# Altium project RemoteBoard.PrjPcb
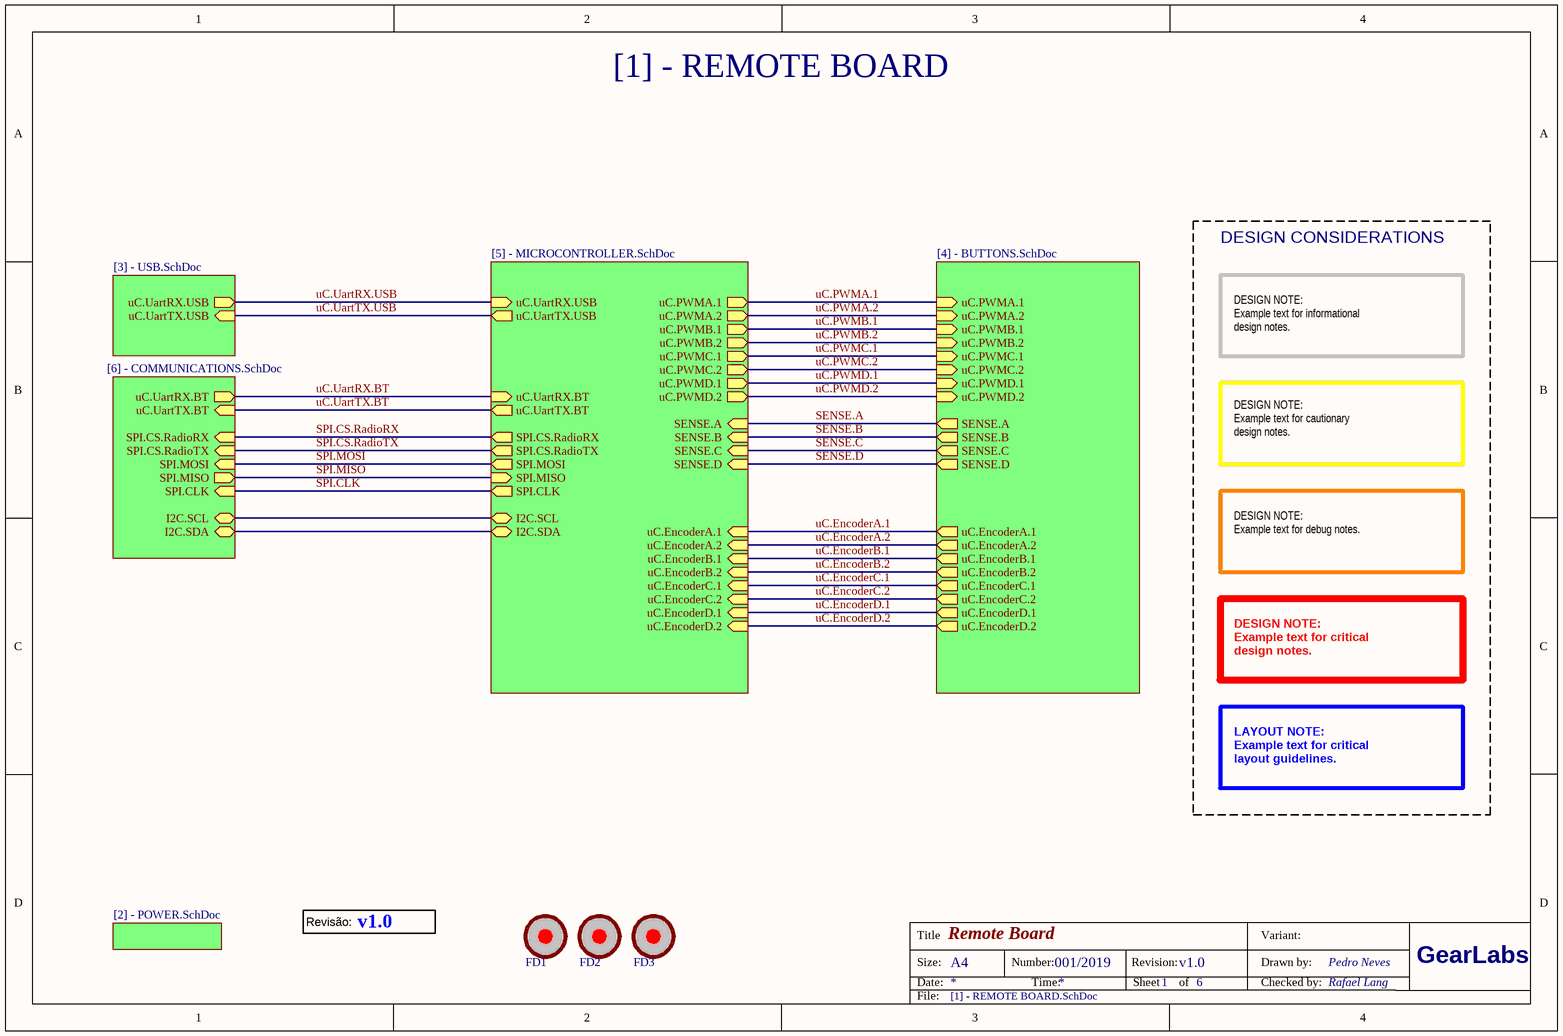
[diagram p0: [1] - REMOTE BOARD.SchDoc]
6 sheets, 119 parts. Net scope: hierarchical (ports join the sheet entries above them; power ports are global).
Sheets:
  [1] - REMOTE BOARD.SchDoc
    uC = [5] - MICROCONTROLLER.SchDoc
    Power = [2] - POWER.SchDoc
    USB = [3] - USB.SchDoc
    Driver = [4] - BUTTONS.SchDoc
    Communications = [6] - COMMUNICATIONS.SchDoc

## Sheet [1] - REMOTE BOARD.SchDoc: Remote Board
size A4; CheckedBy: Rafael Lang; CompanyName: Gear Labs; DrawnBy: Pedro Neves; Organization: Gear Labs; DocumentNumber: 001/2019; Revision: v1.0; SheetNumber: 1; SheetTotal: 6

### Parts
FD1  Fiducial  [Fiducial]  (value not drawn)  (no BOM)
FD2  Fiducial  [Fiducial]  (value not drawn)  (no BOM)
FD3  Fiducial  [Fiducial]  (value not drawn)  (no BOM)
Info1  v1.0  (value not drawn)  (graphical)

### Sub-sheets
Communications = [6] - COMMUNICATIONS.SchDoc: uC.UartRX.BT (out), uC.UartTX.BT (in), SPI.CS.RadioRX (in), SPI.CS.RadioTX (in), SPI.MOSI (in), SPI.MISO (out), SPI.CLK (in), I2C.SCL (bidir), I2C.SDA (bidir)
Driver = [4] - BUTTONS.SchDoc: SENSE.C (out), SENSE.A (out), SENSE.B (out), SENSE.D (out), uC.PWMA.1 (in), uC.EncoderC.2 (out), uC.EncoderC.1 (out), uC.EncoderA.2 (out), uC.EncoderA.1 (out), uC.EncoderB.1 (out), uC.EncoderD.1 (out), uC.EncoderD.2 (out), uC.EncoderB.2 (out), uC.PWMA.2 (in), uC.PWMB.1 (in), uC.PWMB.2 (in), uC.PWMC.1 (in), uC.PWMC.2 (in), uC.PWMD.1 (in), uC.PWMD.2 (in)
Power = [2] - POWER.SchDoc: no entries
uC = [5] - MICROCONTROLLER.SchDoc: SPI.CS.RadioRX (out), SPI.CS.RadioTX (out), SPI.MISO (in), uC.EncoderD.2 (in), SPI.CLK (out), uC.UartRX.BT (in), uC.PWMC.1 (out), uC.EncoderA.1 (in), uC.EncoderC.2 (in), uC.EncoderD.1 (in), uC.UartTX.BT (out), SPI.MOSI (out), uC.UartTX.USB (out), uC.PWMA.2 (out), uC.EncoderC.1 (in), uC.PWMC.2 (out), uC.PWMB.1 (out), uC.UartRX.USB (in), uC.PWMB.2 (out), uC.EncoderB.1 (in), uC.EncoderB.2 (in), uC.PWMA.1 (out), uC.PWMD.2 (out), uC.EncoderA.2 (in), uC.PWMD.1 (out), SENSE.C (in), SENSE.A (in), SENSE.B (in), SENSE.D (in), I2C.SCL (bidir), I2C.SDA (bidir)
USB = [3] - USB.SchDoc: uC.UartTX.USB (in), uC.UartRX.USB (out)

### Nets
I2C.SCL: sheet uC/I2C.SCL, sheet Communications/I2C.SCL
I2C.SDA: sheet uC/I2C.SDA, sheet Communications/I2C.SDA
SENSE.A: sheet uC/SENSE.A, sheet Driver/SENSE.A
SENSE.B: sheet uC/SENSE.B, sheet Driver/SENSE.B
SENSE.C: sheet uC/SENSE.C, sheet Driver/SENSE.C
SENSE.D: sheet uC/SENSE.D, sheet Driver/SENSE.D
SPI.CLK: sheet uC/SPI.CLK, sheet Communications/SPI.CLK
SPI.CS.RadioRX: sheet uC/SPI.CS.RadioRX, sheet Communications/SPI.CS.RadioRX
SPI.CS.RadioTX: sheet uC/SPI.CS.RadioTX, sheet Communications/SPI.CS.RadioTX
SPI.MISO: sheet uC/SPI.MISO, sheet Communications/SPI.MISO
SPI.MOSI: sheet uC/SPI.MOSI, sheet Communications/SPI.MOSI
uC.EncoderA.1: sheet uC/uC.EncoderA.1, sheet Driver/uC.EncoderA.1
uC.EncoderA.2: sheet uC/uC.EncoderA.2, sheet Driver/uC.EncoderA.2
uC.EncoderB.1: sheet uC/uC.EncoderB.1, sheet Driver/uC.EncoderB.1
uC.EncoderB.2: sheet uC/uC.EncoderB.2, sheet Driver/uC.EncoderB.2
uC.EncoderC.1: sheet uC/uC.EncoderC.1, sheet Driver/uC.EncoderC.1
uC.EncoderC.2: sheet uC/uC.EncoderC.2, sheet Driver/uC.EncoderC.2
uC.EncoderD.1: sheet uC/uC.EncoderD.1, sheet Driver/uC.EncoderD.1
uC.EncoderD.2: sheet uC/uC.EncoderD.2, sheet Driver/uC.EncoderD.2
uC.PWMA.1: sheet uC/uC.PWMA.1, sheet Driver/uC.PWMA.1
uC.PWMA.2: sheet uC/uC.PWMA.2, sheet Driver/uC.PWMA.2
uC.PWMB.1: sheet uC/uC.PWMB.1, sheet Driver/uC.PWMB.1
uC.PWMB.2: sheet uC/uC.PWMB.2, sheet Driver/uC.PWMB.2
uC.PWMC.1: sheet uC/uC.PWMC.1, sheet Driver/uC.PWMC.1
uC.PWMC.2: sheet uC/uC.PWMC.2, sheet Driver/uC.PWMC.2
uC.PWMD.1: sheet uC/uC.PWMD.1, sheet Driver/uC.PWMD.1
uC.PWMD.2: sheet uC/uC.PWMD.2, sheet Driver/uC.PWMD.2
uC.UartRX.BT: sheet uC/uC.UartRX.BT, sheet Communications/uC.UartRX.BT
uC.UartRX.USB: sheet uC/uC.UartRX.USB, sheet USB/uC.UartRX.USB
uC.UartTX.BT: sheet uC/uC.UartTX.BT, sheet Communications/uC.UartTX.BT
uC.UartTX.USB: sheet uC/uC.UartTX.USB, sheet USB/uC.UartTX.USB

### Notes on the sheet
- [1] - REMOTE BOARD
- DESIGN CONSIDERATIONS
- DESIGN NOTE:
  Example text for informational
  design notes.
- DESIGN NOTE:
  Example text for cautionary
  design notes.
- DESIGN NOTE:
  Example text for debug notes.
- DESIGN NOTE:
  Example text for critical
  design notes.
- LAYOUT NOTE:
  Example text for critical
  layout guidelines.
- Title
- Size:
- Date:
- A4
- Number:
- Time:
- Revision:
- Sheet
- of
- Drawn by:
- Checked by:
- Variant:
- GearLabs
- File:
- (in symbol Versionamento) Revisão:

### Library data of the parts
Info1 = Versionamento

## Sheet [5] - MICROCONTROLLER.SchDoc: Remote Board
size A4; CheckedBy: Rafael Lang; CompanyName: Gear Labs; DrawnBy: Pedro Neves; Organization: Gear Labs; DocumentNumber: 001/2019; Revision: v1.0; SheetNumber: 5; SheetTotal: 6; ProjectName: Control Board
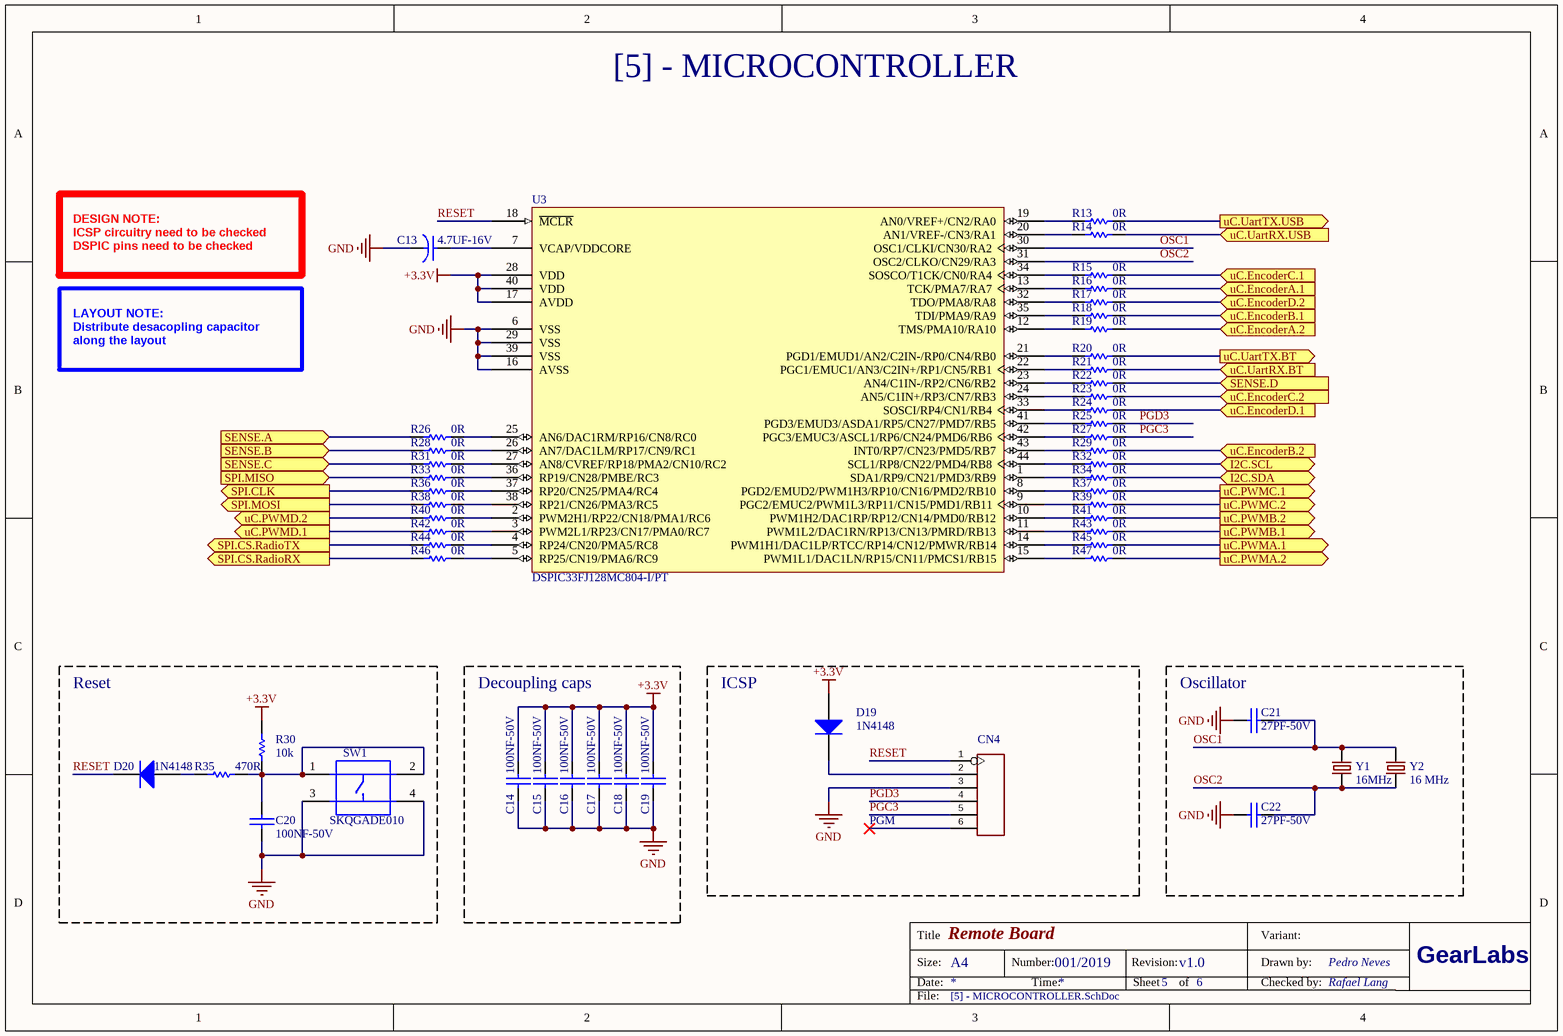
[diagram p1: [5] - MICROCONTROLLER.SchDoc]

### Parts
C13  value 4.7UF-16V  [AVX-A]  (hidden comment: 302020006)
C14  value 100NF-50V  [C0603]  (hidden comment: 302010138)
C15  value 100NF-50V  [C0603]  (hidden comment: 302010138)
C16  value 100NF-50V  [C0603]  (hidden comment: 302010138)
C17  value 100NF-50V  [C0603]  (hidden comment: 302010138)
C18  value 100NF-50V  [C0603]  (hidden comment: 302010138)
C19  value 100NF-50V  [C0603]  (hidden comment: 302010138)
C20  value 100NF-50V  [C0603]  (hidden comment: 302010138)
C21  value 27PF-50V  [C0603]  (hidden comment: 302010142)
C22  value 27PF-50V  [C0603]  (hidden comment: 302010142)
CN4  320030060  [H6-2.54]  (value not drawn)
D19  MPN: 1N4148  [LL-34]  (hidden comment: 304040016)
D20  MPN: 1N4148  [LL-34]  (hidden comment: 304040016)
R13  value 0R  [R0603]  (hidden comment: 301010292)
R14  value 0R  [R0603]  (hidden comment: 301010292)
R15  value 0R  [R0603]  (hidden comment: 301010292)
R16  value 0R  [R0603]  (hidden comment: 301010292)
R17  value 0R  [R0603]  (hidden comment: 301010292)
R18  value 0R  [R0603]  (hidden comment: 301010292)
R19  value 0R  [R0603]  (hidden comment: 301010292)
R20  value 0R  [R0603]  (hidden comment: 301010292)
R21  value 0R  [R0603]  (hidden comment: 301010292)
R22  value 0R  [R0603]  (hidden comment: 301010292)
R23  value 0R  [R0603]  (hidden comment: 301010292)
R24  value 0R  [R0603]  (hidden comment: 301010292)
R25  value 0R  [R0603]  (hidden comment: 301010292)
R26  value 0R  [R0603]  (hidden comment: 301010292)
R27  value 0R  [R0603]  (hidden comment: 301010292)
R28  value 0R  [R0603]  (hidden comment: 301010292)
R29  value 0R  [R0603]  (hidden comment: 301010292)
R30  value 10k  [R0603]  (hidden comment: 301010299)
R31  value 0R  [R0603]  (hidden comment: 301010292)
R32  value 0R  [R0603]  (hidden comment: 301010292)
R33  value 0R  [R0603]  (hidden comment: 301010292)
R34  value 0R  [R0603]  (hidden comment: 301010292)
R35  value 470R  [R0603]  (hidden comment: 301010088)
R36  value 0R  [R0603]  (hidden comment: 301010292)
R37  value 0R  [R0603]  (hidden comment: 301010292)
R38  value 0R  [R0603]  (hidden comment: 301010292)
R39  value 0R  [R0603]  (hidden comment: 301010292)
R40  value 0R  [R0603]  (hidden comment: 301010292)
R41  value 0R  [R0603]  (hidden comment: 301010292)
R42  value 0R  [R0603]  (hidden comment: 301010292)
R43  value 0R  [R0603]  (hidden comment: 301010292)
R44  value 0R  [R0603]  (hidden comment: 301010292)
R45  value 0R  [R0603]  (hidden comment: 301010292)
R46  value 0R  [R0603]  (hidden comment: 301010292)
R47  value 0R  [R0603]  (hidden comment: 301010292)
SW1  MPN: SKQGADE010  [SW4-SMD-5.2X5.2X1.5MM]  (hidden comment: 311020017)
U3  DSPIC33FJ128MC804-I/PT  [TQFP-44]
Y1  value 16MHz  [X2-SMD-5.0X3.2X1.3MM]  (hidden comment: 306010054)
Y2  value 16 MHz  [HC49US]  (hidden comment: 306010014)

### Blocks framed on the sheet
Reset: C20 D20 R30 R35 SW1
Decoupling caps: C14-C19
ICSP: CN4 D19
Oscillator: C21 C22 Y1 Y2

### Ports
I2C.SCL (bidir), I2C.SDA (bidir), SENSE.A (in), SENSE.B (in), SENSE.C (in), SENSE.D (in), SPI.CLK (out), SPI.CS.RadioRX (out), SPI.CS.RadioTX (out), SPI.MISO (in), SPI.MOSI (out), uC.EncoderA.1 (in), uC.EncoderA.2 (in), uC.EncoderB.1 (in), uC.EncoderB.2 (in), uC.EncoderC.1 (in), uC.EncoderC.2 (in), uC.EncoderD.1 (in), uC.EncoderD.2 (in), uC.PWMA.1 (out), uC.PWMA.2 (out), uC.PWMB.1 (out), uC.PWMB.2 (out), uC.PWMC.1 (out), uC.PWMC.2 (out), uC.PWMD.1 (out), uC.PWMD.2 (out), uC.UartRX.BT (in), uC.UartRX.USB (in), uC.UartTX.BT (out), uC.UartTX.USB (out)

### Nets
+3.3V: C14.1 C15.1 C16.1 C17.1 C18.1 C19.1 D19.A(+) R30.2 U3.17(AVDD) U3.28(VDD) U3.40(VDD)
GND: C13.- C14.2 C15.2 C16.2 C17.2 C18.2 C19.2 C20.2 C21.2 C22.2 CN4.3 SW1.3(B0) SW1.4(B1) U3.6(VSS) U3.16(AVSS) U3.29(VSS) U3.39(VSS)
I2C.SCL: R32.2 ; port I2C.SCL
I2C.SDA: R34.2 ; port I2C.SDA
OSC1: C21.1 U3.30(OSC1/CLKI/CN30/RA2) Y1.2 Y2.2
OSC2: C22.1 U3.31(OSC2/CLKO/CN29/RA3) Y1.1 Y2.1
PGC3: CN4.5 R27.2
PGD3: CN4.4 R25.2
RESET: CN4.1 D20.C(-) U3.18(~{MCLR})
SENSE.A: R26.1 ; port SENSE.A
SENSE.B: R28.1 ; port SENSE.B
SENSE.C: R31.1 ; port SENSE.C
SENSE.D: R22.2 ; port SENSE.D
SPI.CLK: R36.1 ; port SPI.CLK
SPI.CS.RadioRX: R46.1 ; port SPI.CS.RadioRX
SPI.CS.RadioTX: R44.1 ; port SPI.CS.RadioTX
SPI.MISO: R33.1 ; port SPI.MISO
SPI.MOSI: R38.1 ; port SPI.MOSI
uC.EncoderA.1: R16.2 ; port uC.EncoderA.1
uC.EncoderA.2: R19.2 ; port uC.EncoderA.2
uC.EncoderB.1: R18.2 ; port uC.EncoderB.1
uC.EncoderB.2: R29.2 ; port uC.EncoderB.2
uC.EncoderC.1: R15.2 ; port uC.EncoderC.1
uC.EncoderC.2: R23.2 ; port uC.EncoderC.2
uC.EncoderD.1: R24.2 ; port uC.EncoderD.1
uC.EncoderD.2: R17.2 ; port uC.EncoderD.2
uC.PWMA.1: R45.2 ; port uC.PWMA.1
uC.PWMA.2: R47.2 ; port uC.PWMA.2
uC.PWMB.1: R43.2 ; port uC.PWMB.1
uC.PWMB.2: R41.2 ; port uC.PWMB.2
uC.PWMC.1: R37.2 ; port uC.PWMC.1
uC.PWMC.2: R39.2 ; port uC.PWMC.2
uC.PWMD.1: R42.1 ; port uC.PWMD.1
uC.PWMD.2: R40.1 ; port uC.PWMD.2
uC.UartRX.BT: R21.2 ; port uC.UartRX.BT
uC.UartRX.USB: R14.2 ; port uC.UartRX.USB
uC.UartTX.BT: R20.2 ; port uC.UartTX.BT
uC.UartTX.USB: R13.2 ; port uC.UartTX.USB
NetC13_+: C13.+ U3.7(VCAP/VDDCORE)
NetC20_1: C20.1 R30.1 R35.2 SW1.1(A0) SW1.2(A1)
NetCN4_2: CN4.2 D19.C(-)
NetD20_A: D20.A(+) R35.1
NetR13_1: R13.1 U3.19(AN0/VREF+/CN2/RA0)
NetR14_1: R14.1 U3.20(AN1/VREF-/CN3/RA1)
NetR15_1: R15.1 U3.34(SOSCO/T1CK/CN0/RA4)
NetR16_1: R16.1 U3.13(TCK/PMA7/RA7)
NetR17_1: R17.1 U3.32(TDO/PMA8/RA8)
NetR18_1: R18.1 U3.35(TDI/PMA9/RA9)
NetR19_1: R19.1 U3.12(TMS/PMA10/RA10)
NetR20_1: R20.1 U3.21(PGD1/EMUD1/AN2/C2IN-/RP0/CN4/RB0)
NetR21_1: R21.1 U3.22(PGC1/EMUC1/AN3/C2IN+/RP1/CN5/RB1)
NetR22_1: R22.1 U3.23(AN4/C1IN-/RP2/CN6/RB2)
NetR23_1: R23.1 U3.24(AN5/C1IN+/RP3/CN7/RB3)
NetR24_1: R24.1 U3.33(SOSCI/RP4/CN1/RB4)
NetR25_1: R25.1 U3.41(PGD3/EMUD3/ASDA1/RP5/CN27/PMD7/RB5)
NetR26_2: R26.2 U3.25(AN6/DAC1RM/RP16/CN8/RC0)
NetR27_1: R27.1 U3.42(PGC3/EMUC3/ASCL1/RP6/CN24/PMD6/RB6)
NetR28_2: R28.2 U3.26(AN7/DAC1LM/RP17/CN9/RC1)
NetR29_1: R29.1 U3.43(INT0/RP7/CN23/PMD5/RB7)
NetR31_2: R31.2 U3.27(AN8/CVREF/RP18/PMA2/CN10/RC2)
NetR32_1: R32.1 U3.44(SCL1/RP8/CN22/PMD4/RB8)
NetR33_2: R33.2 U3.36(RP19/CN28/PMBE/RC3)
NetR34_1: R34.1 U3.1(SDA1/RP9/CN21/PMD3/RB9)
NetR36_2: R36.2 U3.37(RP20/CN25/PMA4/RC4)
NetR37_1: R37.1 U3.8(PGD2/EMUD2/PWM1H3/RP10/CN16/PMD2/RB10)
NetR38_2: R38.2 U3.38(RP21/CN26/PMA3/RC5)
NetR39_1: R39.1 U3.9(PGC2/EMUC2/PWM1L3/RP11/CN15/PMD1/RB11)
NetR40_2: R40.2 U3.2(PWM2H1/RP22/CN18/PMA1/RC6)
NetR41_1: R41.1 U3.10(PWM1H2/DAC1RP/RP12/CN14/PMD0/RB12)
NetR42_2: R42.2 U3.3(PWM2L1/RP23/CN17/PMA0/RC7)
NetR43_1: R43.1 U3.11(PWM1L2/DAC1RN/RP13/CN13/PMRD/RB13)
NetR44_2: R44.2 U3.4(RP24/CN20/PMA5/RC8)
NetR45_1: R45.1 U3.14(PWM1H1/DAC1LP/RTCC/RP14/CN12/PMWR/RB14)
NetR46_2: R46.2 U3.5(RP25/CN19/PMA6/RC9)
NetR47_1: R47.1 U3.15(PWM1L1/DAC1LN/RP15/CN11/PMCS1/RB15)

Not connected (* = marked no-connect by the designer): CN4 6*

### Notes on the sheet
- [5] - MICROCONTROLLER
- DESIGN NOTE:
  ICSP circuitry need to be checked
  DSPIC pins need to be checked
- LAYOUT NOTE:
  Distribute desacopling capacitor along the layout
- PGM
- Title
- Size:
- Date:
- A4
- Number:
- Time:
- Revision:
- Sheet
- of
- Drawn by:
- Checked by:
- Variant:
- GearLabs
- File:

### Library data of the parts
C13 = TANTALUM-SMD-4.7UF-16V(AVX-A): MPN: TAJA475*016#NJ
C14-C20 = CERAMIC-100NF-50V-10%-X7R(0603): MPN: CC0603KRX7R9BB104
C21 C22 = CERAMIC-27PF-50V-5%-NPO(0603): MPN: CC0603JRNPO9BN270
CN4 = DIP-BLACK-FEMALE-HEADER-VERT(6P-2.54): MPN: F185-1106A1BSYC1
D19 D20 = SMD-DIODE-SWITCH-1N4148(LL-34)
R13-R29 R31-R34 R36-R47 = SMD-RES-0R-5%-1/10W(0603): MPN: RC0603JR-070RL
R30 = SMD-RES-10K-1%-1/10W(0603): MPN: RC0603FR-0710KL
R35 = SMD-RES-470R-5%-1/10W(0603): MPN: RC0603JR-07470RL
SW1 = SMD-BUTTON(4P-5.2X5.2X1.5MM-SKQGADE010)-SKQGADE010
U3 = DSPIC33FJ128MC804-I/PT: High-Performance 16-bit Digital Signal Controller, 128 KB Flash, 16 KB RAM, 44-Pin TQFP; FLASH Memory Size: 131072 B; Lead-Free Status: Lead Free; RAM Memory Size: 16384 B; Lifecycle Status: Active; Mounting Style: Surface Mount; Number of Pins: 44; REACH SVHC Compliance: No SVHC; RoHS: Compliant
Y1 = SMD-CRYSTAL-16MHZ-8PF-20PPM-40R(2P-5.0X3.2MM): MPN: X053201602002
Y2 = DIP-CRYSTAL-16MHZ-18PF-30PPM-40R(HC49US): MPN: HC-49US    16.000MHz

## Sheet [2] - POWER.SchDoc: Remote Board
size A4; CheckedBy: Rafael Lang; CompanyName: Gear Labs; DrawnBy: Pedro Neves; Organization: Gear Labs; DocumentNumber: 001/2019; Revision: v1.0; SheetNumber: 2; SheetTotal: 6
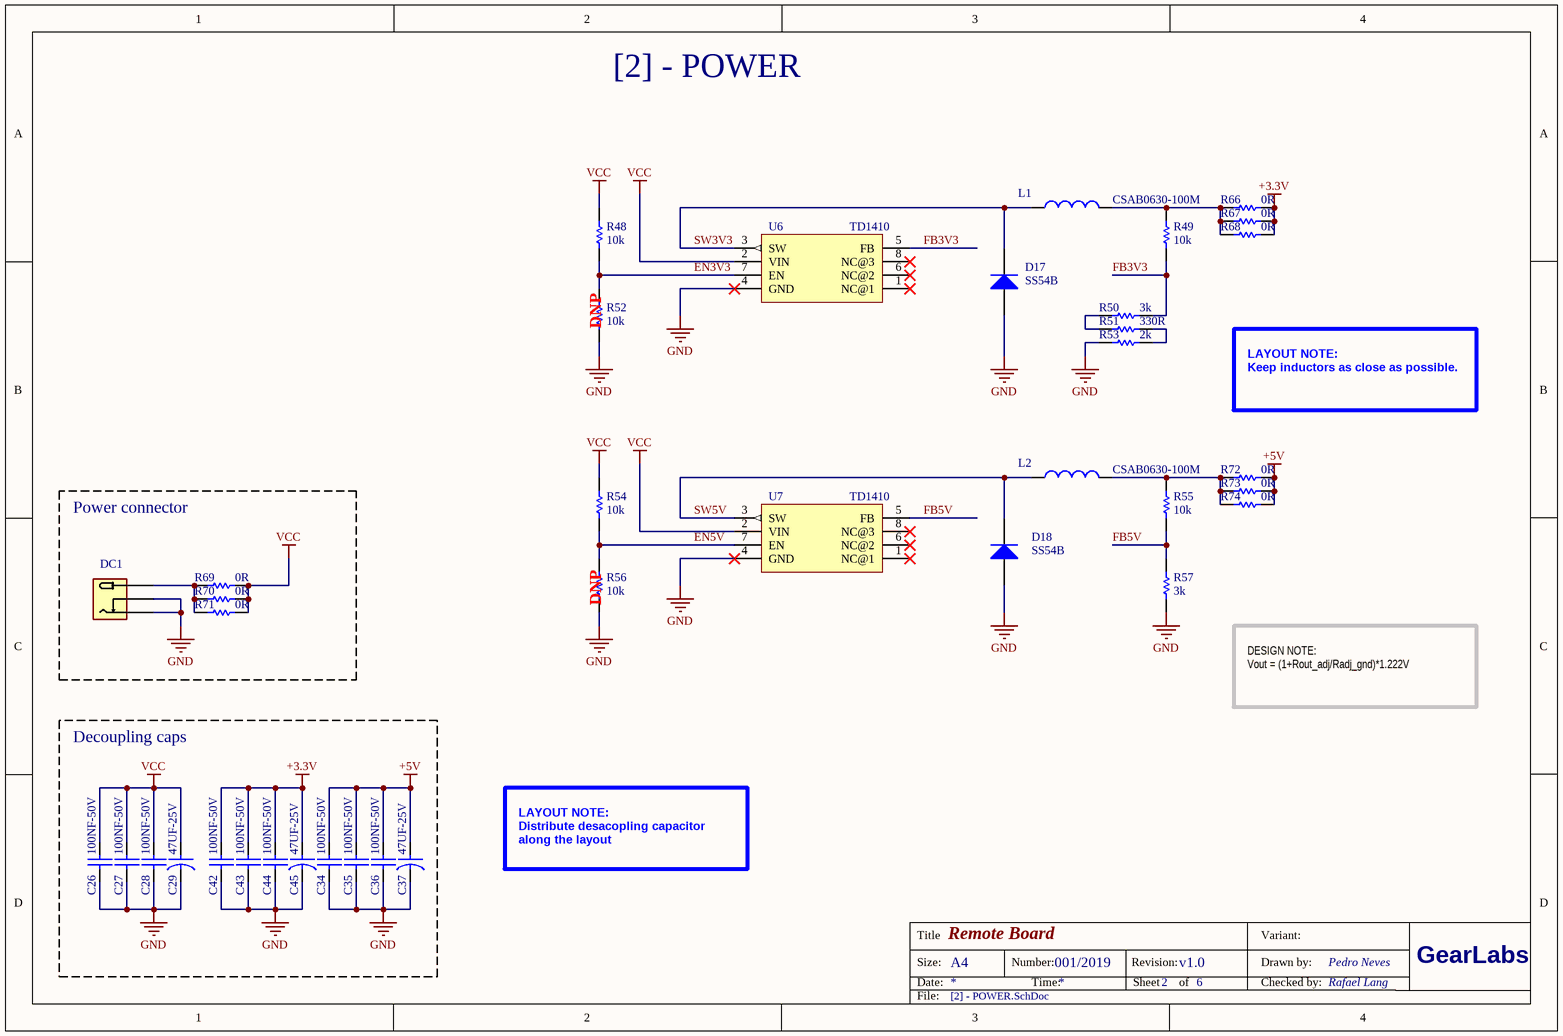
[diagram p2: [2] - POWER.SchDoc]

### Parts
C26  value 100NF-50V  [C0603]  (hidden comment: 302010138)
C27  value 100NF-50V  [C0603]  (hidden comment: 302010138)
C28  value 100NF-50V  [C0603]  (hidden comment: 302010138)
C29  value 47UF-25V  [ELECTRO-SMD-C-6MM]  (hidden comment: 302030059)
C34  value 100NF-50V  [C0603]  (hidden comment: 302010138)
C35  value 100NF-50V  [C0603]  (hidden comment: 302010138)
C36  value 100NF-50V  [C0603]  (hidden comment: 302010138)
C37  value 47UF-25V  [ELECTRO-SMD-C-6MM]  (hidden comment: 302030059)
C42  value 100NF-50V  [C0603]  (hidden comment: 302010138)
C43  value 100NF-50V  [C0603]  (hidden comment: 302010138)
C44  value 100NF-50V  [C0603]  (hidden comment: 302010138)
C45  value 47UF-25V  [ELECTRO-SMD-C-6MM]  (hidden comment: 302030059)
D17  MPN: SS54B  [DO-214AA]  (hidden comment: 304020021)
D18  MPN: SS54B  [DO-214AA]  (hidden comment: 304020021)
DC1  320120003  [3P-L14.2*W11.0*H9.0MM]  (value not drawn)
L1  MPN: CSAB0630-100M  [SMD-2P-L6.0XW6.0XH3.0MM]  (hidden comment: 303010016)
L2  MPN: CSAB0630-100M  [SMD-2P-L6.0XW6.0XH3.0MM]  (hidden comment: 303010016)
R48  value 10k  [R0603]  (hidden comment: 301010293)
R49  value 10k  [R0603]  (hidden comment: 301010299)
R50  value 3k  [R0603]  (hidden comment: 301010170)
R51  value 330R  [R0603]  (hidden comment: 301010300)
R52  value 10k  [R0603]  (hidden comment: 301010293)
R53  value 2k  [R0603]  (hidden comment: 301010221)
R54  value 10k  [R0603]  (hidden comment: 301010293)
R55  value 10k  [R0603]  (hidden comment: 301010299)
R56  value 10k  [R0603]  (hidden comment: 301010293)
R57  value 3k  [R0603]  (hidden comment: 301010170)
R66  value 0R  [R0603]  (hidden comment: 301010292)
R67  value 0R  [R0603]  (hidden comment: 301010292)
R68  value 0R  [R0603]  (hidden comment: 301010292)
R69  value 0R  [R0603]  (hidden comment: 301010292)
R70  value 0R  [R0603]  (hidden comment: 301010292)
R71  value 0R  [R0603]  (hidden comment: 301010292)
R72  value 0R  [R0603]  (hidden comment: 301010292)
R73  value 0R  [R0603]  (hidden comment: 301010292)
R74  value 0R  [R0603]  (hidden comment: 301010292)
U6  TD1410  [SOIC8-1.27-5X4MM]
U7  TD1410  [SOIC8-1.27-5X4MM]

### Blocks framed on the sheet
Power connector: DC1 R69-R71
Decoupling caps: C26-C29 C34-C37 C42-C45

### Nets
+3.3V: C42.1 C43.1 C44.1 C45.+ R66.2 R67.2 R68.2
+5V: C34.1 C35.1 C36.1 C37.+ R72.2 R73.2 R74.2
GND: C26.2 C27.2 C28.2 C29.- C34.2 C35.2 C36.2 C37.- C42.2 C43.2 C44.2 C45.- D17.+ D18.+ DC1.-1(-) DC1.-2(CDN) R52.1 R53.2 R56.1 R57.1 U6.4(GND) U7.4(GND)
VCC: C26.1 C27.1 C28.1 C29.+ R48.2 R54.2 R69.2 R70.2 R71.2 U6.2(VIN) U7.2(VIN)
EN3V3: R48.1 R52.2 U6.7(EN)
EN5V: R54.1 R56.2 U7.7(EN)
FB3V3: R49.1 R50.2 U6.5(FB)
FB5V: R55.1 R57.2 U7.5(FB)
SW3V3: D17.- L1.1 U6.3(SW)
SW5V: D18.- L2.1 U7.3(SW)
NetDC1_+: DC1.+ R69.1 R70.1 R71.1
NetL1_2: L1.2 R49.2 R66.1 R67.1 R68.1
NetL2_2: L2.2 R55.2 R72.1 R73.1 R74.1
NetR50_1: R50.1 R51.2
NetR51_1: R51.1 R53.1

Not connected (* = marked no-connect by the designer): U6 1(NC@1)* 6(NC@2)* 8(NC@3)*; U7 1(NC@1)* 6(NC@2)* 8(NC@3)*

### Notes on the sheet
- [2] - POWER
- (near R52) DNP
- LAYOUT NOTE:
  Keep inductors as close as possible.
- (near R56) DNP
- DESIGN NOTE:
  Vout = (1+Rout_adj/Radj_gnd)*1.222V
- LAYOUT NOTE:
  Distribute desacopling capacitor along the layout
- Title
- Size:
- Date:
- A4
- Number:
- Time:
- Revision:
- Sheet
- of
- Drawn by:
- Checked by:
- Variant:
- GearLabs
- File:

### Library data of the parts
C26-C28 C34-C36 C42-C44 = CERAMIC-100NF-50V-10%-X7R(0603): MPN: CC0603KRX7R9BB104
C29 C37 C45 = ALUMINUM-SMD-47UF-25V(D6.3-H5.3MM): MPN: CS1E470M-CRE54
D17 D18 = SMD-DIODE-SCHOTTKY-28V-5A(DO-214AA)
DC1 = JACK-DC-005'DC-005'
L1 L2 = SMD-INDUCTOR-10UH-20%(2P-6X6MM)'0630'
R48 R52 R54 R56 = SMD-RES-10K-5%-1/10W(0603): MPN: RC0603JR-0710KL
R49 R55 = SMD-RES-10K-1%-1/10W(0603): MPN: RC0603FR-0710KL
R50 R57 = SMD-RES-3K-1%-1/10W(0603): MPN: RC0603FR-073KL
R51 = SMD-RES-330R-1%-1/10W(0603): MPN: RC0603FR-07330RL
R53 = SMD-RES-2K-1%-1/10W(0603): MPN: RC0603FR-072KL
R66-R74 = SMD-RES-0R-5%-1/10W(0603): MPN: RC0603JR-070RL
U6 U7 = PMIC-TD1410(SOIC8): MPN: TD1410

## Sheet [3] - USB.SchDoc: Remote Board
size A4; CheckedBy: Rafael Lang; CompanyName: Gear Labs; DrawnBy: Pedro Neves; Organization: Gear Labs; DocumentNumber: 001/2019; Revision: v1.0; SheetNumber: 3; SheetTotal: 6
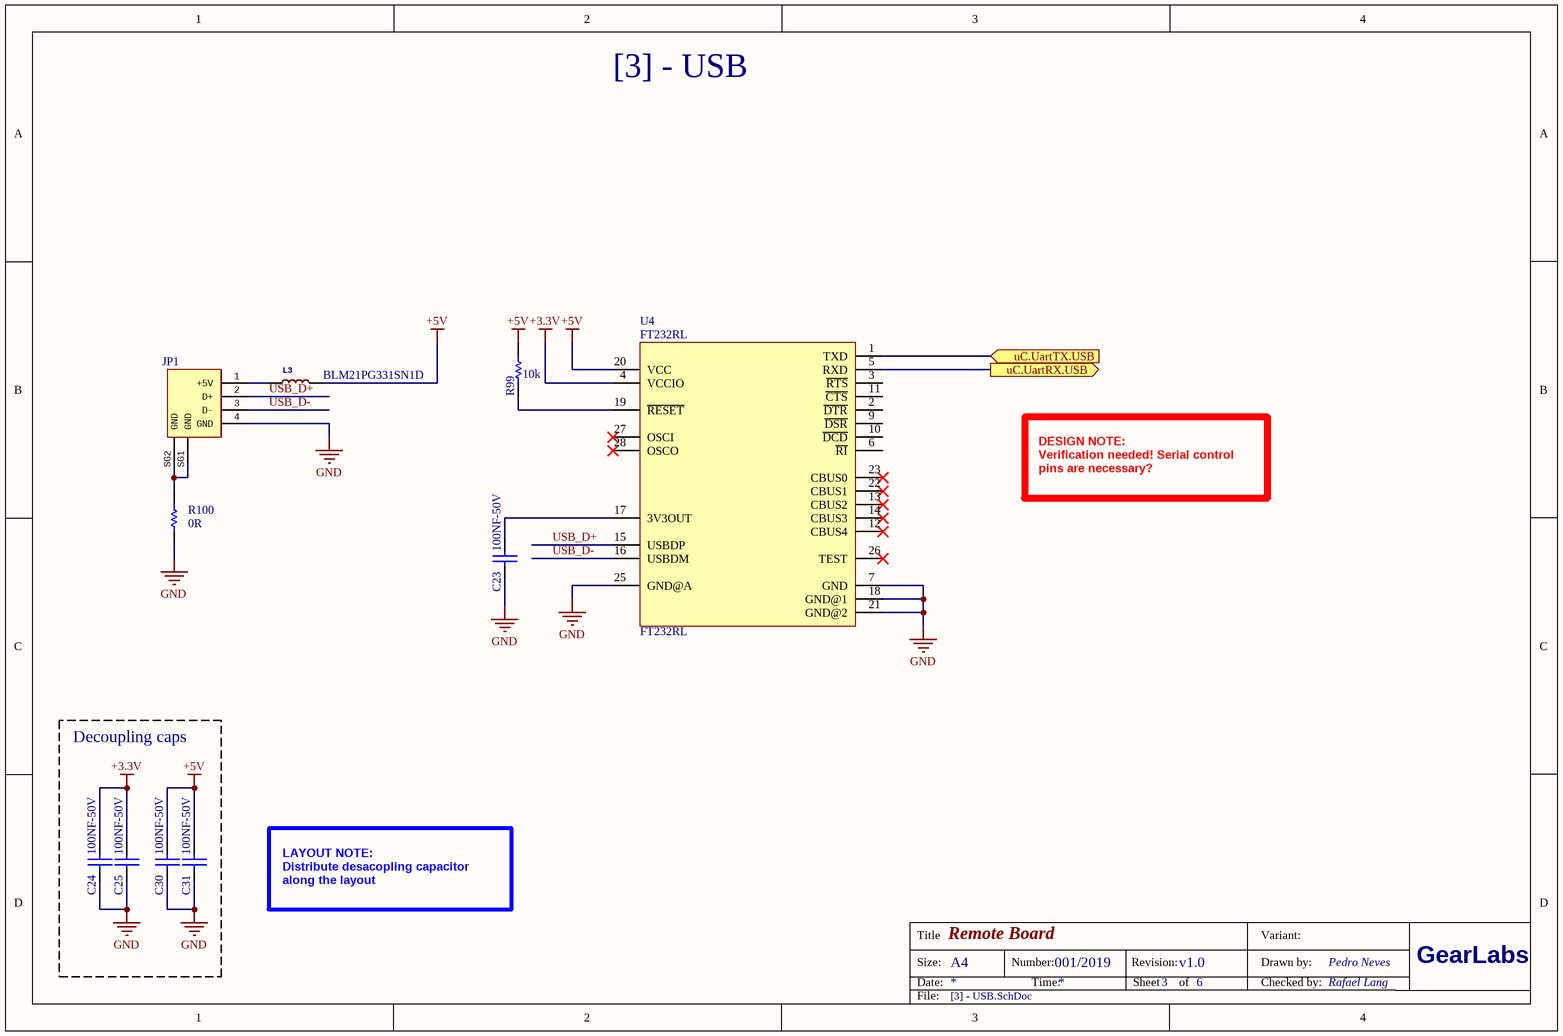
[diagram p3: [3] - USB.SchDoc]

### Parts
C23  value 100NF-50V  [C0603]  (hidden comment: 302010138)
C24  value 100NF-50V  [C0603]  (hidden comment: 302010138)
C25  value 100NF-50V  [C0603]  (hidden comment: 302010138)
C30  value 100NF-50V  [C0603]  (hidden comment: 302010138)
C31  value 100NF-50V  [C0603]  (hidden comment: 302010138)
JP1  320010007  [USB4+2P-2.0-90D]  (value not drawn)
L3  MPN: BLM21PG331SN1D  [L0805]  (hidden comment: 303030006)
R99  value 10k  [R0603]  (hidden comment: 301010293)
R100  value 0R  [R0603]  (hidden comment: 301010292)
U4  FT232RL  [SSOP28-0.65-10.2X5.2MM]

### Blocks framed on the sheet
Decoupling caps: C24 C25 C30 C31

### Ports
uC.UartRX.USB (out), uC.UartTX.USB (in)

### Nets
+3.3V: C24.1 C25.1 U4.4(VCCIO)
+5V: C30.1 C31.1 L3.2 R99.2 U4.20(VCC)
GND: C23.2 C24.2 C25.2 C30.2 C31.2 JP1.4(GND) R100.1 U4.7(GND) U4.18(GND@1) U4.21(GND@2) U4.25(GND@A)
uC.UartRX.USB: U4.5(RXD) ; port uC.UartRX.USB
uC.UartTX.USB: U4.1(TXD) ; port uC.UartTX.USB
USB_D+: JP1.2(D+) U4.15(USBDP)
USB_D-: JP1.3(D-) U4.16(USBDM)
NetC23_1: C23.1 U4.17(3V3OUT)
NetJP1_1: JP1.1(+5V) L3.1
NetJP1_SG1: JP1.SG1(GND) JP1.SG2(GND) R100.2
NetR99_1: R99.1 U4.19(~{RESET})

Not connected (* = marked no-connect by the designer): U4 2(~{DTR}) 3(~{RTS}) 6(~{RI}) 9(~{DSR}) 10(~{DCD}) 11(~{CTS}) 12(CBUS4)* 13(CBUS2)* 14(CBUS3)* 22(CBUS1)* 23(CBUS0)* 26(TEST)* 27(OSCI)* 28(OSCO)*

### Notes on the sheet
- [3] - USB
- DESIGN NOTE:
  Verification needed! Serial control pins are necessary?
- LAYOUT NOTE:
  Distribute desacopling capacitor along the layout
- Title
- Size:
- Date:
- A4
- Number:
- Time:
- Revision:
- Sheet
- of
- Drawn by:
- Checked by:
- Variant:
- GearLabs
- File:

### Library data of the parts
C23-C25 C30 C31 = CERAMIC-100NF-50V-10%-X7R(0603): MPN: CC0603KRX7R9BB104
JP1 = DIP-USB-A-TYPE-FMAL(4+2P-2.0-90D)
L3 = SMD-FERRITE-BEAD-330R-1500MA(0805)'0805'
R99 = SMD-RES-10K-5%-1/10W(0603): MPN: RC0603JR-0710KL
R100 = SMD-RES-0R-5%-1/10W(0603): MPN: RC0603JR-070RL
U4 = INTERFACE-FT232RL(SSOP28): MPN: FT232RL

## Sheet [4] - BUTTONS.SchDoc: Remote Board
size A4; CheckedBy: Rafael Lang; CompanyName: Gear Labs; DrawnBy: Pedro Neves; Organization: Gear Labs; DocumentNumber: 001/2019; Revision: v1.0; SheetNumber: 4; SheetTotal: 6
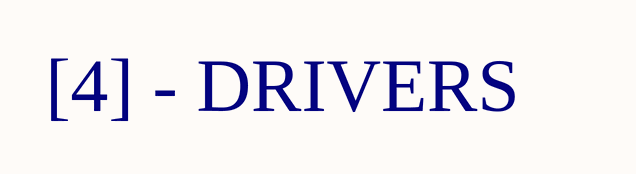
[diagram p4: [4] - BUTTONS.SchDoc]

### Notes on the sheet
- [4] - DRIVERS
- Title
- Size:
- Date:
- A4
- Number:
- Time:
- Revision:
- Sheet
- of
- Drawn by:
- Checked by:
- Variant:
- GearLabs
- File:

## Sheet [6] - COMMUNICATIONS.SchDoc: Remote Board
size A4; CheckedBy: Rafael Lang; CompanyName: Gear Labs; DrawnBy: Pedro Neves; Organization: Gear Labs; DocumentNumber: 001/2019; Revision: v1.0; SheetNumber: 6; SheetTotal: 6
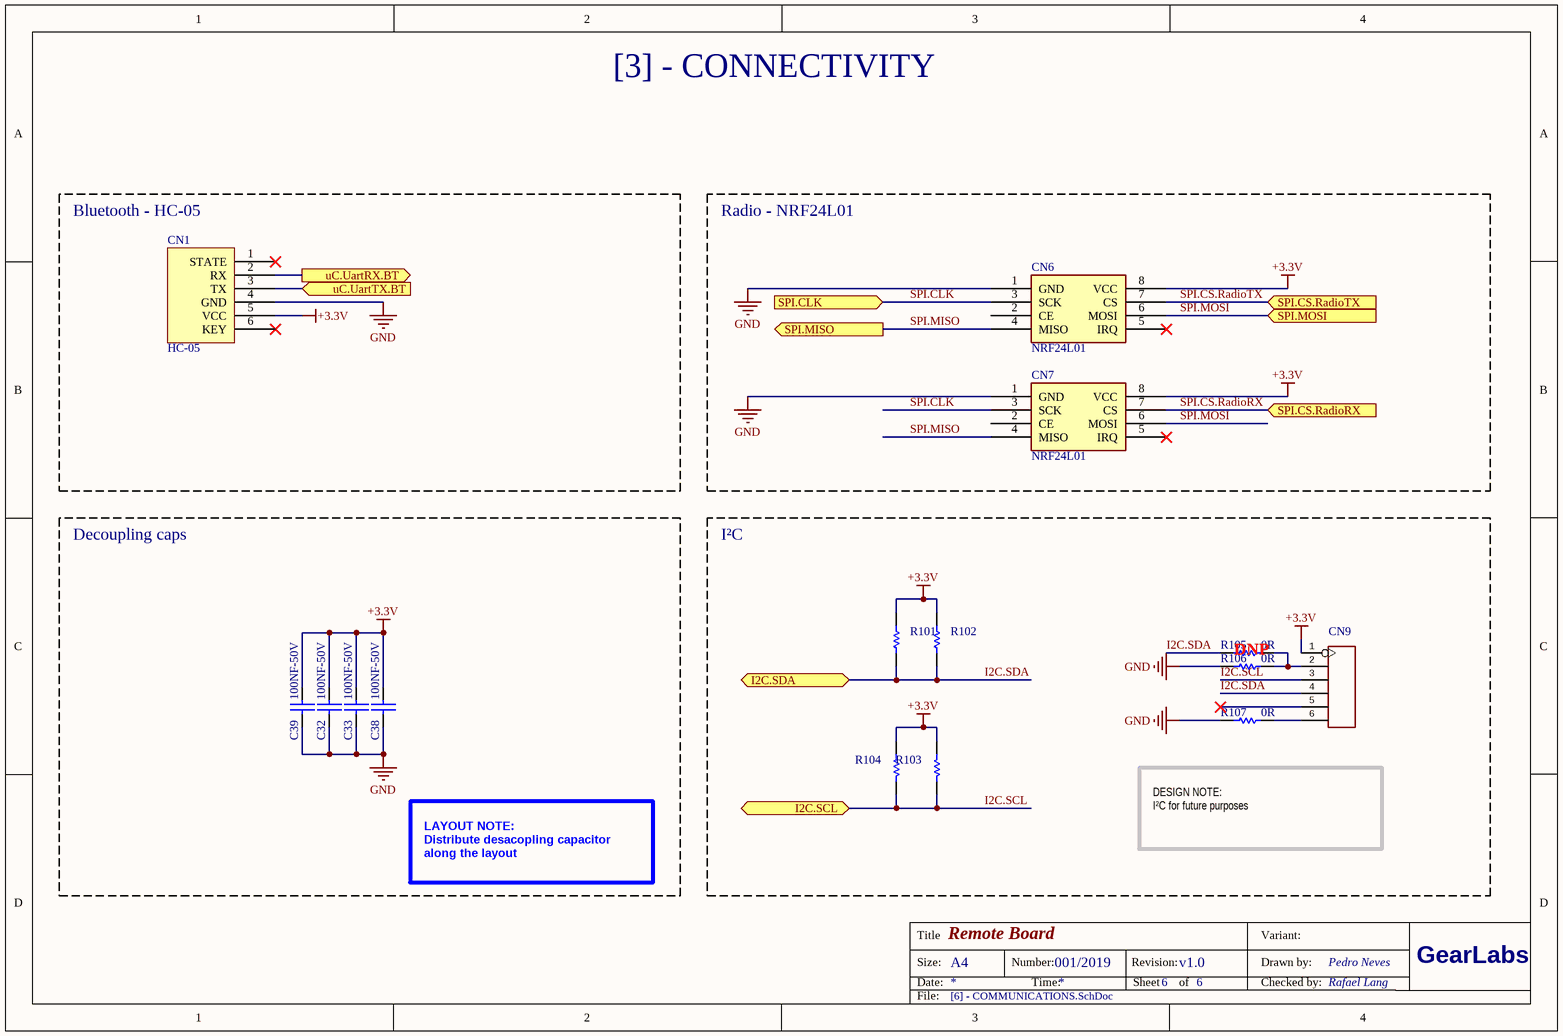
[diagram p5: [6] - COMMUNICATIONS.SchDoc]

### Parts
C32  value 100NF-50V  [C0603]  (hidden comment: 302010138)
C33  value 100NF-50V  [C0603]  (hidden comment: 302010138)
C38  value 100NF-50V  [C0603]  (hidden comment: 302010138)
C39  value 100NF-50V  [C0603]  (hidden comment: 302010138)
CN1  HC-05  [HC-05]
CN6  NRF24L01  [NRF24l01]
CN7  NRF24L01  [NRF24l01]
CN9  320030060  [H6-2.54]  (value not drawn)
R101  301010299  [R0603]  (value not drawn)
R102  301010299  [R0603]  (value not drawn)
R103  301010299  [R0603]  (value not drawn)
R104  301010299  [R0603]  (value not drawn)
R105  value 0R  [R0603]  (hidden comment: 301010292)
R106  value 0R  [R0603]  (hidden comment: 301010292)
R107  value 0R  [R0603]  (hidden comment: 301010292)

### Blocks framed on the sheet
Bluetooth - HC-05: CN1
Radio - NRF24L01: CN6 CN7
Decoupling caps: C32 C33 C38 C39

### Ports
I2C.SCL (bidir), I2C.SDA (bidir), SPI.CLK (in), SPI.CS.RadioRX (in), SPI.CS.RadioTX (in), SPI.MISO (out), SPI.MOSI (in), uC.UartRX.BT (out), uC.UartTX.BT (in)

### Nets
+3.3V: C32.1 C33.1 C38.1 C39.1 CN1.5(VCC) CN6.8(VCC) CN7.8(VCC) CN9.1 R101.2 R102.2 R103.2 R104.2
GND: C32.2 C33.2 C38.2 C39.2 CN1.4(GND) CN6.1(GND) CN7.1(GND) R106.1 R107.1
I2C.SCL: CN9.3 R103.1 R104.1 ; port I2C.SCL
I2C.SDA: CN9.4 R101.1 R102.1 R105.1 ; port I2C.SDA
SPI.CLK: CN6.3(SCK) CN7.3(SCK) ; port SPI.CLK
SPI.CS.RadioRX: CN7.7(CS) ; port SPI.CS.RadioRX
SPI.CS.RadioTX: CN6.7(CS) ; port SPI.CS.RadioTX
SPI.MISO: CN6.4(MISO) CN7.4(MISO) ; port SPI.MISO
SPI.MOSI: CN6.6(MOSI) CN7.6(MOSI) ; port SPI.MOSI
uC.UartRX.BT: CN1.2(RX) ; port uC.UartRX.BT
uC.UartTX.BT: CN1.3(TX) ; port uC.UartTX.BT
NetCN9_2: CN9.2 R105.2 R106.2
NetCN9_6: CN9.6 R107.2

Not connected (* = marked no-connect by the designer): CN1 1(STATE)* 6(KEY)*; CN6 2(CE) 5(IRQ)*; CN7 2(CE) 5(IRQ)*; CN9 5*

### Notes on the sheet
- [3] - CONNECTIVITY
- I²C
- (near R105) DNP
- DESIGN NOTE:
  I²C for future purposes
- LAYOUT NOTE:
  Distribute desacopling capacitor along the layout
- Title
- Size:
- Date:
- A4
- Number:
- Time:
- Revision:
- Sheet
- of
- Drawn by:
- Checked by:
- Variant:
- GearLabs
- File:

### Library data of the parts
C32 C33 C38 C39 = CERAMIC-100NF-50V-10%-X7R(0603): MPN: CC0603KRX7R9BB104
CN9 = DIP-BLACK-FEMALE-HEADER-VERT(6P-2.54): MPN: F185-1106A1BSYC1
R101-R104 = SMD-RES-10K-1%-1/10W(0603): MPN: RC0603FR-0710KL
R105-R107 = SMD-RES-0R-5%-1/10W(0603): MPN: RC0603JR-070RL
CN1 = HC-05: value: HC-05
CN6 CN7 = NRF24L01: value: NRF24L01

## Nets that join several sheets
+3.3V: [5] - MICROCONTROLLER (11 pins), [2] - POWER (7 pins), [3] - USB (C24.1 C25.1 U4.4), [6] - COMMUNICATIONS (12 pins)
+5V: [2] - POWER (7 pins), [3] - USB (5 pins)
GND: [5] - MICROCONTROLLER (17 pins), [2] - POWER (22 pins), [3] - USB (11 pins), [6] - COMMUNICATIONS (9 pins)
I2C.SCL: [5] - MICROCONTROLLER (R32.2), [6] - COMMUNICATIONS (CN9.3 R103.1 R104.1)
I2C.SDA: [5] - MICROCONTROLLER (R34.2), [6] - COMMUNICATIONS (CN9.4 R101.1 R102.1 R105.1)
SPI.CLK: [5] - MICROCONTROLLER (R36.1), [6] - COMMUNICATIONS (CN6.3 CN7.3)
SPI.CS.RadioRX: [5] - MICROCONTROLLER (R46.1), [6] - COMMUNICATIONS (CN7.7)
SPI.CS.RadioTX: [5] - MICROCONTROLLER (R44.1), [6] - COMMUNICATIONS (CN6.7)
SPI.MISO: [5] - MICROCONTROLLER (R33.1), [6] - COMMUNICATIONS (CN6.4 CN7.4)
SPI.MOSI: [5] - MICROCONTROLLER (R38.1), [6] - COMMUNICATIONS (CN6.6 CN7.6)
uC.UartRX.BT: [5] - MICROCONTROLLER (R21.2), [6] - COMMUNICATIONS (CN1.2)
uC.UartRX.USB: [5] - MICROCONTROLLER (R14.2), [3] - USB (U4.5)
uC.UartTX.BT: [5] - MICROCONTROLLER (R20.2), [6] - COMMUNICATIONS (CN1.3)
uC.UartTX.USB: [5] - MICROCONTROLLER (R13.2), [3] - USB (U4.1)

## Assembly variants
A: not fitted R52 R56 R62 R63 R64 R65 R75 R77 R87 R89 R105